# Altium schematic sheet Straingauge.SchDoc
size A4; SheetNumber: 2; SheetTotal: 5
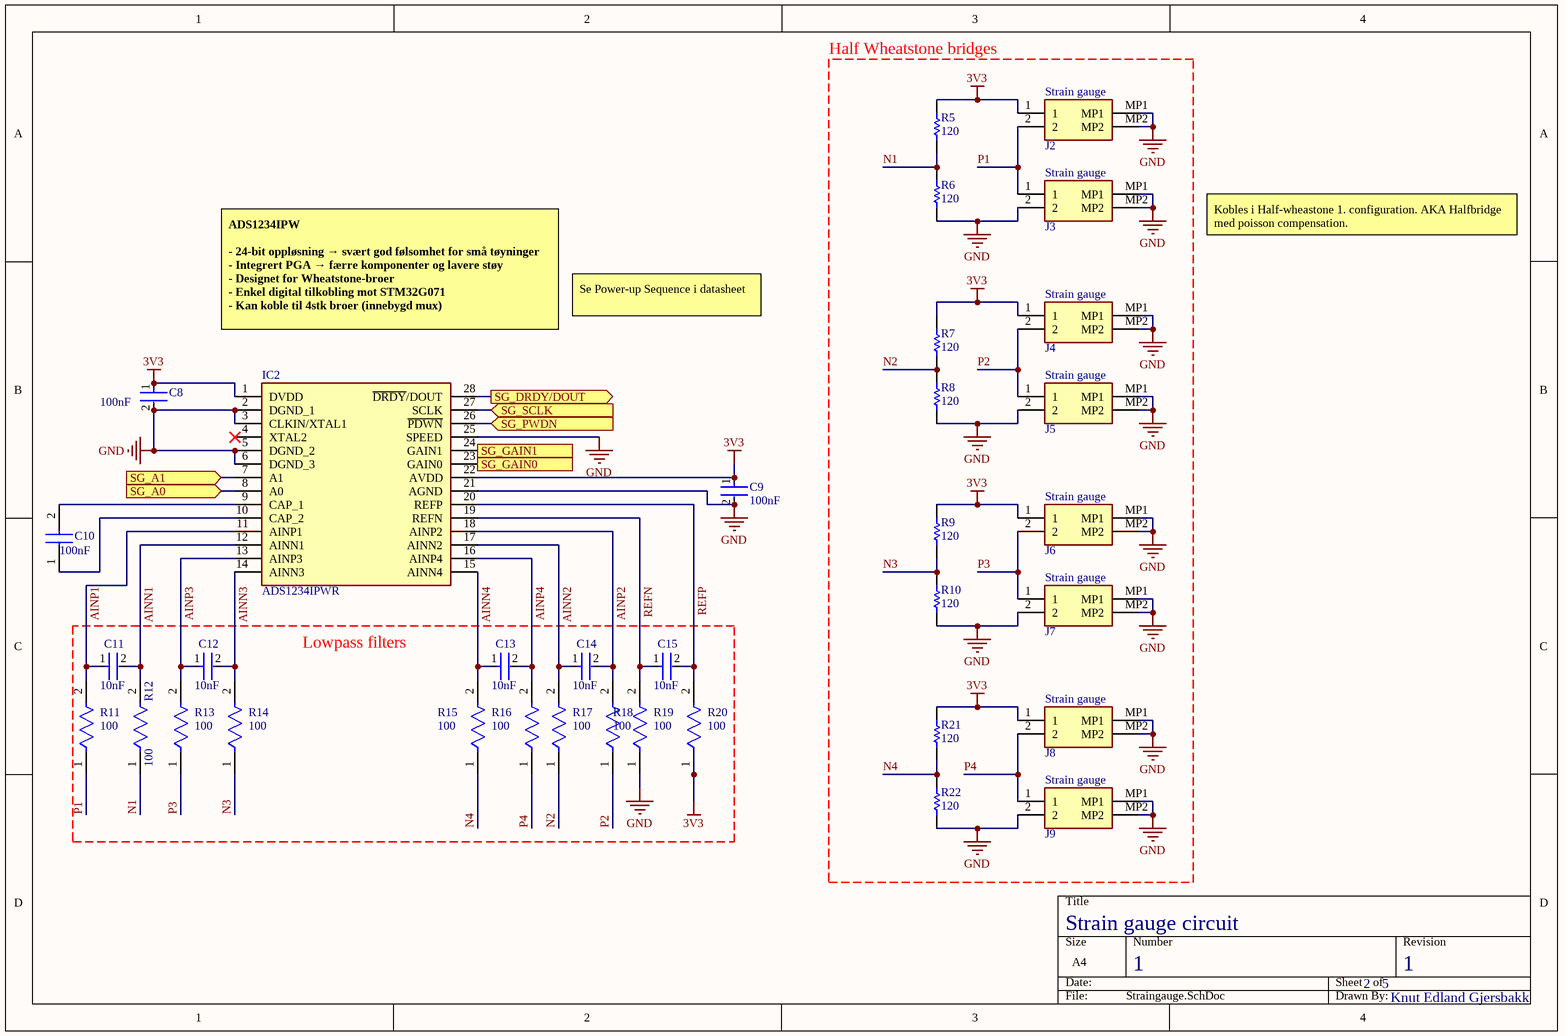
[diagram p0: Straingauge.SchDoc]

## Parts
C8  100nF  [FP-CL10-IPC_C]
C9  100nF  [FP-CL10-IPC_C]
C10  100nF  [CAPC3216X180N]
C11  Capacitance: 10nF  [FP-GRM219-0_1-IPC_B]  (hidden comment: GRM2195C1H103JA01D)
C12  Capacitance: 10nF  [FP-GRM219-0_1-IPC_B]  (hidden comment: GRM2195C1H103JA01D)
C13  Capacitance: 10nF  [FP-GRM219-0_1-IPC_B]  (hidden comment: GRM2195C1H103JA01D)
C14  Capacitance: 10nF  [FP-GRM219-0_1-IPC_B]  (hidden comment: GRM2195C1H103JA01D)
C15  Capacitance: 10nF  [FP-GRM219-0_1-IPC_B]  (hidden comment: GRM2195C1H103JA01D)
IC2  ADS1234IPWR  [SOP65P640X120-28N]
J2  S2B-PH-SM4-TB_LF__SN_  [S2BPHSM4TBLFSN]  (value not drawn)
J3  S2B-PH-SM4-TB_LF__SN_  [S2BPHSM4TBLFSN]  (value not drawn)
J4  S2B-PH-SM4-TB_LF__SN_  [S2BPHSM4TBLFSN]  (value not drawn)
J5  S2B-PH-SM4-TB_LF__SN_  [S2BPHSM4TBLFSN]  (value not drawn)
J6  S2B-PH-SM4-TB_LF__SN_  [S2BPHSM4TBLFSN]  (value not drawn)
J7  S2B-PH-SM4-TB_LF__SN_  [S2BPHSM4TBLFSN]  (value not drawn)
J8  S2B-PH-SM4-TB_LF__SN_  [S2BPHSM4TBLFSN]  (value not drawn)
J9  S2B-PH-SM4-TB_LF__SN_  [S2BPHSM4TBLFSN]  (value not drawn)
R5  120  [RESC2013X60X40ML20T25]
R6  120  [RESC2013X60X40ML20T25]
R7  120  [RESC2013X60X40ML20T25]
R8  120  [RESC2013X60X40ML20T25]
R9  120  [RESC2013X60X40ML20T25]
R10  120  [RESC2013X60X40ML20T25]
R11  100  [FP-ERA3A-IPC_B]
R12  100  [FP-ERA3A-IPC_B]
R13  100  [FP-ERA3A-IPC_B]
R14  100  [FP-ERA3A-IPC_B]
R15  100  [FP-ERA3A-IPC_B]
R16  100  [FP-ERA3A-IPC_B]
R17  100  [FP-ERA3A-IPC_B]
R18  100  [FP-ERA3A-IPC_B]
R19  100  [FP-ERA3A-IPC_B]
R20  100  [FP-ERA3A-IPC_B]
R21  120  [RESC2013X60X40ML20T25]
R22  120  [RESC2013X60X40ML20T25]

## Blocks framed on the sheet
Half Wheatstone bridges: J2-J9 R5-R10 R21 R22
Lowpass filters: C11-C15 R11-R20

## Ports
SG_A0 (in, see Toplevel[3B]), SG_A1 (in, see Toplevel[3B]), SG_DRDY/DOUT (out, see Toplevel[3B]), SG_GAIN0 (in, see Toplevel[2B]), SG_GAIN1 (in, see Toplevel[2B]), SG_PWDN (in, see Toplevel[2B]), SG_SCLK (in, see Toplevel[2B])

## Nets
3V3: C8.1 C9.1 IC2.1(DVDD) IC2.22(AVDD) J2.1 J4.1 J6.1 J8.1 R5.2 R7.2 R9.2 R20.1 R21.2
GND: C8.2 C9.2 IC2.2(DGND_1) IC2.3(CLKIN/XTAL1) IC2.5(DGND_2) IC2.6(DGND_3) IC2.21(AGND) IC2.25(SPEED) J2.MP1 J2.MP2 J3.2 J3.MP1 J3.MP2 J4.MP1 J4.MP2 J5.2 J5.MP1 J5.MP2 J6.MP1 J6.MP2 J7.2 J7.MP1 J7.MP2 J8.MP1 J8.MP2 J9.2 J9.MP1 J9.MP2 R6.1 R8.1 R10.1 R19.1 R22.1
AINN1: C11.2 IC2.12(AINN1) R12.2
AINN2: C14.1 IC2.17(AINN2) R17.2
AINN3: C12.2 IC2.14(AINN3) R14.2
AINN4: C13.1 IC2.15(AINN4) R15.2
AINP1: C11.1 IC2.11(AINP1) R11.2
AINP2: C14.2 IC2.18(AINP2) R18.2
AINP3: C12.1 IC2.13(AINP3) R13.2
AINP4: C13.2 IC2.16(AINP4) R16.2
N1: R5.1 R6.2 R12.1
N2: R7.1 R8.2 R17.1
N3: R9.1 R10.2 R14.1
N4: R15.1 R21.1 R22.2
P1: J2.2 J3.1 R11.1
P2: J4.2 J5.1 R18.1
P3: J6.2 J7.1 R13.1
P4: J8.2 J9.1 R16.1
REFN: C15.1 IC2.19(REFN) R19.2
REFP: C15.2 IC2.20(REFP) R20.2
SG_A0: IC2.8(A0) ; port SG_A0
SG_A1: IC2.7(A1) ; port SG_A1
SG_DRDY/DOUT: IC2.28(~{DRDY}/DOUT) ; port SG_DRDY/DOUT
SG_GAIN0: IC2.23(GAIN0) ; port SG_GAIN0
SG_GAIN1: IC2.24(GAIN1) ; port SG_GAIN1
SG_PWDN: IC2.26(~{PDWN}) ; port SG_PWDN
SG_SCLK: IC2.27(SCLK) ; port SG_SCLK
NetC10_1: C10.1 IC2.10(CAP_2)
NetC10_2: C10.2 IC2.9(CAP_1)

Not connected (* = marked no-connect by the designer): IC2 4(XTAL2)*

## Notes on the sheet
- (near J2) Strain gauge
- (near J3) Strain gauge
- Kobles i Half-wheastone 1. configuration. AKA Halfbridge med poisson compensation.
- Se Power-up Sequence i datasheet
- (near J4) Strain gauge
- ADS1234IPW
  - 24-bit oppløsning → svært god følsomhet for små tøyninger
  - Integrert PGA → færre komponenter og lavere støy
  - Designet for Wheatstone-broer
  - Enkel digital tilkobling mot STM32G071
  - Kan koble til 4stk broer (innebygd mux)
  Gain bør settes til 64 for Half bridge
- (near J5) Strain gauge
- (near J6) Strain gauge
- (near J7) Strain gauge
- (near J8) Strain gauge
- (near J9) Strain gauge
- Strain gauge circuit
- 1
- 2
- 5
- Knut Edland Gjersbakk

## Library data of the parts
C8 C9 = CMP-13271-002683-1: Cap Ceramic 100nF 16V X7R ±10% Pad SMD 0603 +125°C T/R / CL10B104KO8WPNC; Voltage Rating: 16V; Max Operating Temperature: 125°C; Capacitance: 100nF; Features: Soft Termination; Length: 0.063inch; Packaging: Tape and Reel; Min Operating Temperature: -55°C; Mount: Surface Mount; Case/Package: 0603; Case Code (Metric): 1608; Width: 0.031inch; Ratings: AEC-Q200; Thickness: 0.035inch; Case Code (Imperial): 0603; Tolerance: 10%
C10 = GRM31C5C1E104JA01L: Capacitor; Manufacturer_Name: Murata Electronics; Datasheet Link: https://search.murata.co.jp/Ceramy/image/img/A01X/G101/ENG/GRM31C5C1E104JA01-01A.pdf; Height: 1.8mm; Manufacturer_Part_Number: GRM31C5C1E104JA01L; Mouser Part Number: 81-GRM31C5C1E104JA01; Mouser Price/Stock: https://www.mouser.co.uk/ProductDetail/Murata-Electronics/GRM31C5C1E104JA01L?qs=Iy3qAC6%2FTQjjy5bmw5NuQw%3D%3D; Arrow Part Number: GRM31C5C1E104JA01L; Arrow Price/Stock: https://www.arrow.com/en/products/grm31c5c1e104ja01l/murata-manufacturing?region=nac; Supplier 1: Avnet; Supplier Part Number 1: GRM31C5C1E104JA01L
C11-C15 = CMP-2007-00135-2: Chip Multilayer Ceramic Capacitors for General Purpose, 0805, 10000pF, C0G, 30ppm/°C, 5%, 50V; Insulation Resistance: 10GR; Max Operating Temperature: 125°C; Height: 0.85mm; Voltage: 50V; Dielectric Material: Ceramic; Voltage Rating: 50V; Dielectric: C0G; Thickness: 0.037inch; REACH SVHC: No SVHC; Lead Free: Lead Free; Depth: 1.25mm; Min Operating Temperature: -55°C; Package Quantity: 1; Packaging: Tape and Reel; Case Code (Imperial): 0805; Case/Package: 0805; Mount: Surface Mount; Width: 0.049inch; Case Code (Metric): 2012; Length: 2mm; Termination: SMD/SMT; Material: Ceramic; Tolerance: 5%; Temperature Coefficient: 30ppm/°C; Number of Pins: 2; Voltage Rating (DC): 50V; Radiation Hardening: No
IC2 = ADS1234IPWR: Integrated Circuit; Manufacturer_Name: Texas Instruments; Datasheet Link: http://www.ti.com/lit/gpn/ADS1234; Height: 1.2mm; Manufacturer_Part_Number: ADS1234IPWR; Mouser Part Number: 595-ADS1234IPWR; Mouser Price/Stock: https://www.mouser.co.uk/ProductDetail/Texas-Instruments/ADS1234IPWR?qs=RaXRGs7zCv7Rr7lBA3sshA%3D%3D; Arrow Part Number: ADS1234IPWR; Arrow Price/Stock: https://www.arrow.com/en/products/ads1234ipwr/texas-instruments
J2-J9 = S2B-PH-SM4-TB_LF__SN_: Connector; Manufacturer_Name: JST (JAPAN SOLDERLESS TERMINALS); Manufacturer_Part_Number: S2B-PH-SM4-TB(LF)(SN); Datasheet Link: https://www.jst-mfg.com/product/pdf/eng/ePH.pdf; Height: 6.6mm; Mouser Part Number: N/A; Mouser Price/Stock: https://www.mouser.co.uk/ProductDetail/JST-Commercial/S2B-PH-SM4-TBLFSN?qs=QpmGXVUTftEA9IU90i0xlg%3D%3D; Arrow Part Number: S2B-PH-SM4-TB(LF)(SN); Arrow Price/Stock: https://www.arrow.com/en/products/s2b-ph-sm4-tb-lf-sn/jst-manufacturing?utm_currency=USD&region=europe
R5-R10 R21 R22 = CMP-2001-00588-1: Manufacturer: Panasonic; Part Number: ERA6AEB121V
R11-R20 = CMP-2000-00870-2: RES SMD 100 OHM 0.1% 1/10W 0603; Voltage Rating: 75V; Power Rating: 100mW; Resistance: 100R; Temperature Coefficient: 25ppm/°C; Number of Terminations: 2; Case/Package: 0603; Termination: SMD/SMT; Number of Pins: 2; Size Code: 0603; Length: 1.6mm; Min Operating Temperature: -55°C; Resistor Type: Thin Film; Depth: 0.8mm; Military Standard: Not; Packaging: Tape and Reel; RoHS Compliant: Yes; Construction: Rectangular; Resistance Tolerance: 0.1%; Contact Plating: Tin; Width: 0.8mm; Mount: Surface Mount; Case Code (Metric): 1608; Max Operating Temperature: 155°C; Height: 0.45mm; Case Code (Imperial): 0603; Series: ERA-3A; Package Quantity: 5000; REACH SVHC: No SVHC; Tolerance: 0.1%; Max Power Dissipation: 100mW; Radiation Hardening: No; Technology: METAL FILM